# EAGLE design femtoUSB_r1.0.1_BREADBOARD (EAGLE 7.5.0)
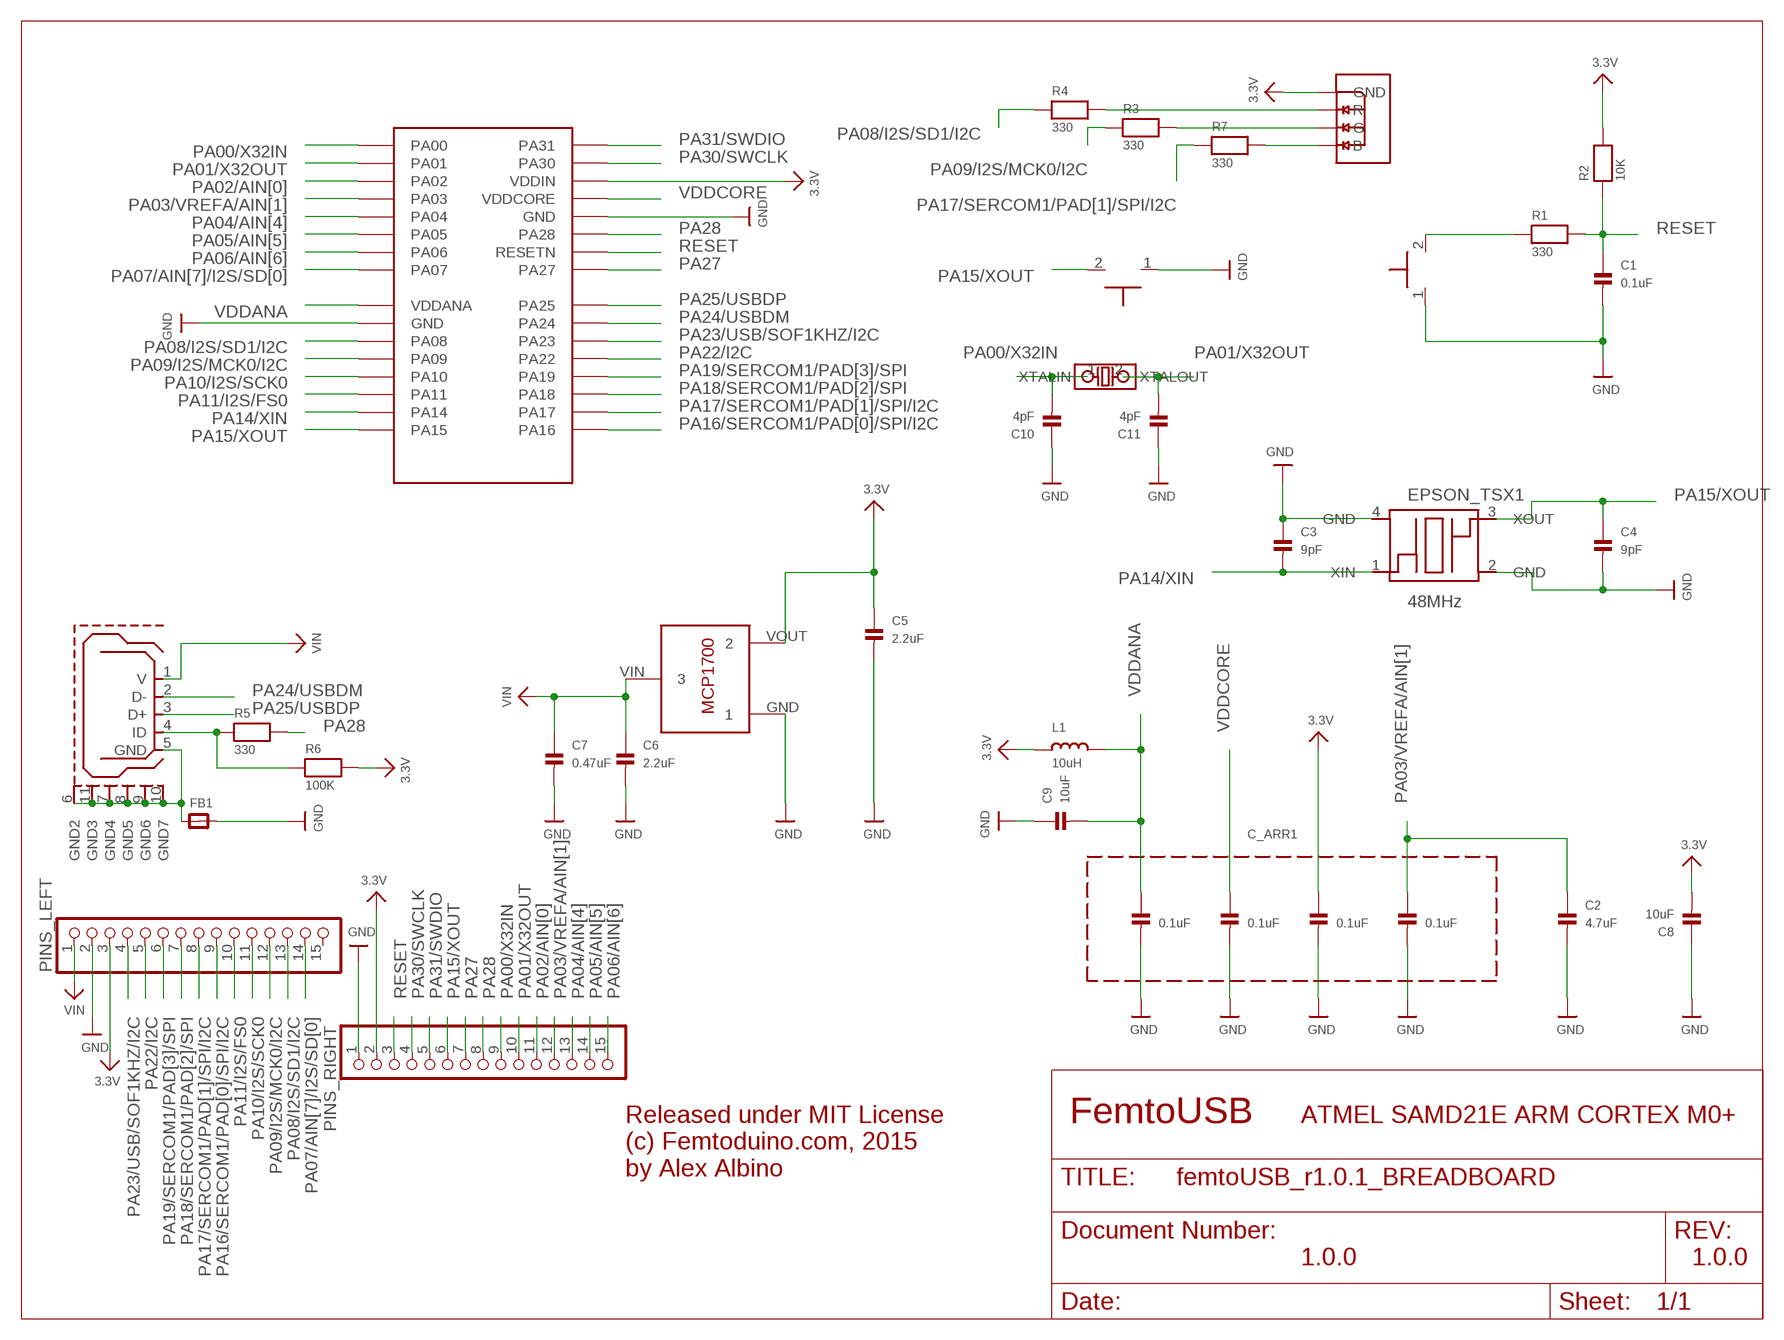
[diagram p0: schematic, sheet 1]

## Parts
BOOT_BTN  TACTILE_SWITCH_NO_GND_NO_BOSS  [SIDE_ACT_NO_GND_NO_BOSS]
BOOT_BTN1  TACTILE_SWITCH_NO_GND_NO_BOSS  [SIDE_ACT_NO_GND_NO_BOSS]
C1  0.1uF  CAP_CERAMIC_0402MP  [_0402MP]
C2  4.7uF  CAP_CERAMIC_0402MP  [_0402MP]
C3  9pF  CAP_CERAMIC_0402MP  [_0402MP]
C4  9pF  CAP_CERAMIC_0402MP  [_0402MP]
C5  2.2uF  CAP_CERAMIC_0402MP  [_0402MP]
C6  2.2uF  CAP_CERAMIC_0402MP  [_0402MP]
C7  0.47uF  CAP_CERAMIC_0402MP  [_0402MP]
C8  10uF  CAP_CERAMIC_0402MP  [_0402MP]
C9  10uF  CAP_CERAMIC_0402MP  [_0402MP]
C10  4pF  CAP_CERAMIC_0402MP  [_0402MP]
C11  4pF  CAP_CERAMIC_0402MP  [_0402MP]
C_ARR1  0.1uF  KEMET_CERAMIC_CAPACITOR_ARRAY_1X4  [CAPACITOR_ARRAY_1206_MONO_1X4]
EPSON_TSX1  48MHz  TSX-3225  [TSX-3225]
FB1  FERRITE_0603MP  [_0603MP]
IC1  ATSAMD21E18A-MUT  [QFN32]
L1  10uH  INDUCTOR_0603MP  [_0603MP]
LDO_VREG  MCP1700T-3302E/TT  [MCP1700T-3302E/TT]
MICRO_B_USB  USB_MICROB  [USB_MICROB_PACKAGE]
PINS_LEFT  HEADER-1X15  [1X15_ROUND_70]
PINS_RIGHT  HEADER-1X15  [1X15_ROUND_70]
R1  330  RESISTOR_0402MP  [_0402MP]
R2  10K  RESISTOR_0402MP  [_0402MP]
R3  330  RESISTOR_0402MP  [_0402MP]
R4  330  RESISTOR_0402MP  [_0402MP]
R5  330  RESISTOR_0402MP  [_0402MP]
R6  100K  RESISTOR_0402MP  [_0402MP]
R7  330  RESISTOR_0402MP  [_0402MP]
RGBLED  LRTB_R48G  [LRTB_R48G]
U$40  ABS06-107-32.768KHZ-T  [ABS06-107-32.768KHZ-T]

## Nets
3.3V: C5.1 C8.2 C_ARR1.5 IC1.30(VDDIN) L1.1 LDO_VREG.VOUT PINS_LEFT.3 PINS_RIGHT.2 R2.2 R6.2 RGBLED.1(GND)
GND: BOOT_BTN1.1 BOOT_BTN.1 C1.2 C2.2 C3.1 C4.2 C5.2 C6.2 C7.2 C8.1 C9.1 C10.1 C11.1 C_ARR1.2 C_ARR1.4 C_ARR1.6 C_ARR1.8 EPSON_TSX1.2(GND) EPSON_TSX1.4(GND) FB1.2 IC1.10(GND) IC1.28(GND) LDO_VREG.GND PINS_LEFT.2 PINS_RIGHT.1
GND_RAW: FB1.1 MICRO_B_USB.5(GND) MICRO_B_USB.6(GND2) MICRO_B_USB.7(GND4) MICRO_B_USB.8(GND5) MICRO_B_USB.9(GND6) MICRO_B_USB.10(GND7) MICRO_B_USB.11(GND3)
N$3: MICRO_B_USB.4(ID) R5.1 R6.1
N$26: BOOT_BTN1.2 R1.1
PA00/X32IN: C10.2 IC1.1(PA00) PINS_RIGHT.9 U$40.1(XTALIN)
PA01/X32OUT: C11.2 IC1.2(PA01) PINS_RIGHT.10 U$40.2(XTALOUT)
PA02/AIN[0]: IC1.3(PA02) PINS_RIGHT.11
PA03/VREFA/AIN[1]: C2.1 C_ARR1.7 IC1.4(PA03) PINS_RIGHT.12
PA04/AIN[4]: IC1.5(PA04) PINS_RIGHT.13
PA05/AIN[5]: IC1.6(PA05) PINS_RIGHT.14
PA06/AIN[6]: IC1.7(PA06) PINS_RIGHT.15
PA07/AIN[7]/I2S/SD[0]: IC1.8(PA07) PINS_LEFT.14
PA08/I2S/SD1/I2C: IC1.11(PA08) PINS_LEFT.13 R4.1
PA08_R: R4.2 RGBLED.2(R)
PA09/I2S/MCK0/I2C: IC1.12(PA09) PINS_LEFT.12 R3.1
PA09_G: R3.2 RGBLED.3(G)
PA10/I2S/SCK0: IC1.13(PA10) PINS_LEFT.11
PA11/I2S/FS0: IC1.14(PA11) PINS_LEFT.10
PA14/XIN: C3.2 EPSON_TSX1.1(XIN) IC1.15(PA14)
PA15/XOUT: BOOT_BTN.2 C4.1 EPSON_TSX1.3(XOUT) IC1.16(PA15) PINS_RIGHT.6
PA16/SERCOM1/PAD[0]/SPI/I2C: IC1.17(PA16) PINS_LEFT.9
PA17/SERCOM1/PAD[1]/SPI/I2C: IC1.18(PA17) PINS_LEFT.8 R7.1
PA17_B: R7.2 RGBLED.4(B)
PA18/SERCOM1/PAD[2]/SPI: IC1.19(PA18) PINS_LEFT.7
PA19/SERCOM1/PAD[3]/SPI: IC1.20(PA19) PINS_LEFT.6
PA22/I2C: IC1.21(PA22) PINS_LEFT.5
PA23/USB/SOF1KHZ/I2C: IC1.22(PA23) PINS_LEFT.4
PA24/USBDM: IC1.23(PA24) MICRO_B_USB.2(D-)
PA25/USBDP: IC1.24(PA25) MICRO_B_USB.3(D+)
PA27: IC1.25(PA27) PINS_RIGHT.7
PA28: IC1.27(PA28) PINS_RIGHT.8 R5.2
PA30/SWCLK: IC1.31(PA30) PINS_RIGHT.4
PA31/SWDIO: IC1.32(PA31) PINS_RIGHT.5
RESET: C1.1 IC1.26(RESETN) PINS_RIGHT.3 R1.2 R2.1
VDDANA: C9.2 C_ARR1.1 IC1.9(VDDANA) L1.2
VDDCORE: C_ARR1.3 IC1.29(VDDCORE)
VIN: C6.1 C7.1 LDO_VREG.VIN MICRO_B_USB.1(V) PINS_LEFT.1
Unconnected: PINS_LEFT.15

## Notes on the sheet
- FemtoUSB | ATMEL SAMD21E ARM CORTEX M0+
- Released under MIT License
  (c) Femtoduino.com, 2015
  by Alex Albino
- 1.0.0 | 1.0.0

## Library data of the parts
BOOT_BTN BOOT_BTN1 = omron_tactile_switch:TACTILE_SWITCH_NO_GND_NO_BOSS
C1 = microbuilder:CAP_CERAMIC: Ceramic Capacitors 0402 - 0402 Surface Mount Capacitors 16pF 50V 5% [Digikey: 445-4899-2-ND] 18pF 50V 5% [Digikey: 490-1281-2-ND] 22pF 50V 5% [Digikey: 490-1283-2-ND] 68pF 50V 5% [Digikey: 490-1289-2-ND] 0.1uF 10V 10% [Digikey: 490-1318-2-ND] 1.0uF 6.3V 10% [Digikey: 490-1320-2-ND] 0603 - 0603 Surface Mount Capacitors 16 pF 50V 5% [Digikey: 445-5051-2-ND] 22 pF 50V [Digikey: PCC220ACVTR-ND] 33 pF 50V 5% [Digikey: 490-1415-1-ND] 56pF 50V 5% [Digikey: 490-1421-1-ND] 220pF 50V 5% [Digikey: 445-1285-1-ND] 680 pF 50V 2200 pF 50V 5% C0G [Digikey: 445-1297-1-ND] 5600 pF 100V 5% X7R [Digikey: 478-3711-1-ND] 0.1 µF 25V 10% [Digikey: PCC2277TR-ND] 0.22 µF 16V 10% X7R [Digikey: 445-1318-1-ND] 1.0 µF 25V 10% [Digikey: 445-5146-2-ND] 0603 - RF Specific 3pF 250V +/-0.1pF RF [Digikey: 712-1347-1-ND] 18 pF 250V 5% [Digikey: 478-3505-1-ND or 712-1322-1-ND] 56 pF 250V 5% C0G RF [Digikey: 490-4867-1-ND] 68 pF 250V RF [Digikey: 490-4868-1-ND] 0805 - 0805 Surface Mount Capacitors 220 pF 250V 2% RF Ceramic Capacitor [Digikey: 712-1398-1-ND] 1000 pF 50V 2% NP0 Ceramic Capacitor [Digikey: 478-3760-1-ND] 0.1 µF 25V 10% Ceramic Capacitor [Digikey: PCC1828TR-ND] 1.0 µF 16V 10% Ceramic Capacitor[Digikey: 490-1691-2-ND] 10.0 µF 10V 10% Ceramic Capacitor[Digikey: 709-1228-1-ND] 10.0 uF 16V 10% Ceramic Capacitor [Digikey: 478-5165-2-ND] 47 uF 6.3V 20% Ceramic Capacitor [Digikey: 587-1779-1-ND or 399-5506-1-ND] 1206 - 1206 Surface Mount Capacitors 47uF 10V 20% Ceramic Capacitor [Digikey: 490-5528-1-ND or 399-5508-1-ND or 445-6010-1-ND] 100uF 6.3V -20%, +80% Y5V Ceramic Capacitor (Digikey: 490-4512-1-ND, Mouser: 81-GRM31CF50J107ZE1L); DIGIKEY_PART: 445-4958-1-ND
C2-C11 = microbuilder:CAP_CERAMIC: Ceramic Capacitors 0402 - 0402 Surface Mount Capacitors 16pF 50V 5% [Digikey: 445-4899-2-ND] 18pF 50V 5% [Digikey: 490-1281-2-ND] 22pF 50V 5% [Digikey: 490-1283-2-ND] 68pF 50V 5% [Digikey: 490-1289-2-ND] 0.1uF 10V 10% [Digikey: 490-1318-2-ND] 1.0uF 6.3V 10% [Digikey: 490-1320-2-ND] 0603 - 0603 Surface Mount Capacitors 16 pF 50V 5% [Digikey: 445-5051-2-ND] 22 pF 50V [Digikey: PCC220ACVTR-ND] 33 pF 50V 5% [Digikey: 490-1415-1-ND] 56pF 50V 5% [Digikey: 490-1421-1-ND] 220pF 50V 5% [Digikey: 445-1285-1-ND] 680 pF 50V 2200 pF 50V 5% C0G [Digikey: 445-1297-1-ND] 5600 pF 100V 5% X7R [Digikey: 478-3711-1-ND] 0.1 µF 25V 10% [Digikey: PCC2277TR-ND] 0.22 µF 16V 10% X7R [Digikey: 445-1318-1-ND] 1.0 µF 25V 10% [Digikey: 445-5146-2-ND] 0603 - RF Specific 3pF 250V +/-0.1pF RF [Digikey: 712-1347-1-ND] 18 pF 250V 5% [Digikey: 478-3505-1-ND or 712-1322-1-ND] 56 pF 250V 5% C0G RF [Digikey: 490-4867-1-ND] 68 pF 250V RF [Digikey: 490-4868-1-ND] 0805 - 0805 Surface Mount Capacitors 220 pF 250V 2% RF Ceramic Capacitor [Digikey: 712-1398-1-ND] 1000 pF 50V 2% NP0 Ceramic Capacitor [Digikey: 478-3760-1-ND] 0.1 µF 25V 10% Ceramic Capacitor [Digikey: PCC1828TR-ND] 1.0 µF 16V 10% Ceramic Capacitor[Digikey: 490-1691-2-ND] 10.0 µF 10V 10% Ceramic Capacitor[Digikey: 709-1228-1-ND] 10.0 uF 16V 10% Ceramic Capacitor [Digikey: 478-5165-2-ND] 47 uF 6.3V 20% Ceramic Capacitor [Digikey: 587-1779-1-ND or 399-5506-1-ND] 1206 - 1206 Surface Mount Capacitors 47uF 10V 20% Ceramic Capacitor [Digikey: 490-5528-1-ND or 399-5508-1-ND or 445-6010-1-ND] 100uF 6.3V -20%, +80% Y5V Ceramic Capacitor (Digikey: 490-4512-1-ND, Mouser: 81-GRM31CF50J107ZE1L)
C_ARR1 = array-capacitor:KEMET_CERAMIC_CAPACITOR_ARRAY_1X4
EPSON_TSX1 = crystals:TSX-3225; DIGIKEY_PART: TSX-3225 32.0000MF15X-B-ND
FB1 = microbuilder:FERRITE: Ferrite Bead 0603 MMZ1608B121C - 120 Ohm @ 100MHz, 600mA, 0.15 Ohm DC Resistance - Digikey: 445-2164-1-ND BK1608HW121-T - 120 Ohm, 600mA Ferrite Chip - Digikey: 587-1876-2-ND 0805 HZ0805B272R-10 - 2.7K Ohm @ 100MHz, 200mA, 0.8 Ohm DC Resistance - Digikey: 240-2504-1-ND (see also Murata BLM21BD272SN1L) MMZ2012Y152B - 1.5K Ohm @ 100MHz, 500mA, 0.4 Ohm DC Resistance - Digikey: 445-1560-1-ND - Mainly for high frequency (80-400MHz) MMZ2012R102A - 1K Ohm @ 100MHz, 500mA, 0.3 Ohm DC Resistance - Digikey: 445-1555-2-ND - More general purpose (10-200MHz)
IC1 = atmel-samd21:ATSAMD21E18A-MUT: This is the ATMEL SAMD21E QFN-32. ATSAMD21E18A; DIGIKEY_PART: ATSAMD21E18A-AU-ND
L1 = microbuilder:INDUCTOR: Inductors 0603: 10nH Ceramic Inductor - microwire antenna/RF (Digikey: 712-1434-2-ND) 0805: 560nH Ceramic Inductor - RF (Digikey: 553-1047-1-ND) 270nH Ceramic Inductor - Q = 40@250MHz, +-5%, 1 Ohm DC Resistance (Digikey: 535-10506-2-ND) 1007 (2518 Metric) SMT: 10µH 10% 250mOhm 820mA 1007 Inductor (Digikey: 587-2189-1-ND) 22µH 10% 500mOhm 580mA 1007 Inductor (Digikey: 587-2190-1-ND) 47µH 10% 950mOhm 420mA 1007 Inductor (Digikey: 587-2191-1-ND) 47µH 5% 100mOhm 1A 1008 Inductor (Digikey: 732-1816-1-ND) 5.0x5.0mm (Taiyo Yuden NR5040 Series) 6.8µH 20% 2.3A 64mOhm Inductor (Digikey: 587-2374-2-ND) 5.0x5.0mm (TDK VLC5045 Series) 4.7µH 20% 3.3A 34mOhm Inductor (Digikey: 445-6526-1-ND) 6.8µH 20% 2.7A 46mOhm Inductor (Digikey: 445-6527-1-ND) 6.0x6.0mm (TDK VLC6045 Series) 4.7µH 20% 3.8A 27mOhm Inductor (Digikey: 445-6538-2-ND) 6.8µH 20% 3A 41mOhm Inductor (Digikey: 445-6540-1-ND) 6.2µH 30% 2.2A 45mOhm Inductor (Digikey: SRR5028-6R2YCT-ND) - Not TDK VLC6045 but footprint should match 6.0x6.0mm (TDK SLF6045 Series) 6.8uH 30% 2A 33mOhm Inductor (Digikey: 445-4572-1-ND, Mouser: 810-SLF645T6R8N2R0PF)
LDO_VREG = MCP1700T-3302E_TT:MCP1700T-3302E/TT: Microchip LDO "MCP1700" in a 3-Pin SOT-23 package. ID: MCP1700T-3302E/TT
MICRO_B_USB = femtoduino:USB_MICROB: This is the hirose ZX62-B-5PA(11) MICRO-USB B Type female connection.
PINS_LEFT PINS_RIGHT = microbuilder:HEADER-1X15: 1x15 Header
R1 = microbuilder:RESISTOR: Resistors 0402 - 0402 Surface Mount Package 22 Ohm 1% 1/16W [Digikey: 311-22.0LRTR-ND] 33 Ohm 5% 1/16W 1.0K 5% 1/16W 1.5K 5% 1/16W 2.0K 1% 1/16W 10.0K 1% 1/16W [Digikey: 311-10.0KLRTR-ND] 10.0K 5% 1/16W [Digikey: RMCF0402JT10K0TR-ND] 12.1K 1% 1/16W [Digikey: 311-22.0LRTR-ND] 100.0K 5% 1/16W 0603 - 0603 Surface Mount Package 0 Ohm 1/10 Watt 1% Resistor 15 Ohm 1/10 Watt 1% Resistor 33 Ohm 1/10 Watt 1% Resistor 49.9 Ohm 1/10 Watt 1% Resistor 100 Ohm 1/10 Watt 1% Resistor 150 Ohm 1/10 Watt 1% Resistor 240 Ohm 1/10 Watt 1% Resistor 390 Ohm 1/10 Watt 1% Resistor 560 Ohm 1/10 Watt 1% Resistor 680 Ohm 1/10 Watt 1% Resistor 750 Ohm 1/10 Watt 1% Resistor 1.0K Ohm 1/10 Watt 1% Resistor 1.5K Ohm 1/10 Watt 1% Resistor 2.0K Ohm 1/10 Watt 1% Resistor 2.2K Ohm 1/10 Watt 1% Resistor 3.3K Ohm 1/10 Watt 1% Resistor 4.7K Ohm 1/10 Watt 1% Resistor 10.0K Ohm 1/10 Watt 1% Resistor 12.0K Ohm 1/10 Watt 1% Resistor 12.1K Ohm 1/10 Watt 1% Resistor 20.0K Ohm 1/10 Watt 1% Resistor 33.0K Ohm 1/10 Watt 1% Resistor 100.0K Ohm 1/10 Watt 1% Resistor 0805 - 0805 Surface Mount Package 0 Ohm 1/8 Watt 1% Resistor 33 Ohm 1/8 Watt 1% Resistor 100 Ohm 1/8 Watt 1% Resistor 150 Ohm 1/8 Watt 1% Resistor 200 Ohm 1/8 Watt 1% Resistor 240 Ohm 1/8 Watt 1% Resistor 330 Ohm 1/8 Watt 1% Resistor 390 Ohm 1/8 Watt 1% Resistor 470 Ohm 1/8 Watt 1% Resistor 1.0K Ohm 1/8 Watt 1% Resistor 1.5K Ohm 1/8 Watt 1% Resistor 2.0K Ohm 1/8 Watt 1% Resistor 4.7K Ohm 1/8 Watt 1% Resistor 5.1K Ohm 1/8 Watt 1% Resistor 5.6K Ohm 1/8 Watt 1% Resistor 10.0K Ohm 1/8 Watt 1% Resistor 22.0K Ohm 1/8 Watt 1% Resistor 33.0K Ohm 1/8 Watt 1% Resistor 100K Ohm 1/8 Watt 1% Resistor 1206 - 1206 Surface Mount Package 2012 - 2010 Surface Mount Package 0.11 Ohm 1/2 Watt 1% Resistor - Digikey: RHM.11UCT-ND; DIGIKEY_PART: 541-330JCT-ND
R2-R7 = microbuilder:RESISTOR: Resistors 0402 - 0402 Surface Mount Package 22 Ohm 1% 1/16W [Digikey: 311-22.0LRTR-ND] 33 Ohm 5% 1/16W 1.0K 5% 1/16W 1.5K 5% 1/16W 2.0K 1% 1/16W 10.0K 1% 1/16W [Digikey: 311-10.0KLRTR-ND] 10.0K 5% 1/16W [Digikey: RMCF0402JT10K0TR-ND] 12.1K 1% 1/16W [Digikey: 311-22.0LRTR-ND] 100.0K 5% 1/16W 0603 - 0603 Surface Mount Package 0 Ohm 1/10 Watt 1% Resistor 15 Ohm 1/10 Watt 1% Resistor 33 Ohm 1/10 Watt 1% Resistor 49.9 Ohm 1/10 Watt 1% Resistor 100 Ohm 1/10 Watt 1% Resistor 150 Ohm 1/10 Watt 1% Resistor 240 Ohm 1/10 Watt 1% Resistor 390 Ohm 1/10 Watt 1% Resistor 560 Ohm 1/10 Watt 1% Resistor 680 Ohm 1/10 Watt 1% Resistor 750 Ohm 1/10 Watt 1% Resistor 1.0K Ohm 1/10 Watt 1% Resistor 1.5K Ohm 1/10 Watt 1% Resistor 2.0K Ohm 1/10 Watt 1% Resistor 2.2K Ohm 1/10 Watt 1% Resistor 3.3K Ohm 1/10 Watt 1% Resistor 4.7K Ohm 1/10 Watt 1% Resistor 10.0K Ohm 1/10 Watt 1% Resistor 12.0K Ohm 1/10 Watt 1% Resistor 12.1K Ohm 1/10 Watt 1% Resistor 20.0K Ohm 1/10 Watt 1% Resistor 33.0K Ohm 1/10 Watt 1% Resistor 100.0K Ohm 1/10 Watt 1% Resistor 0805 - 0805 Surface Mount Package 0 Ohm 1/8 Watt 1% Resistor 33 Ohm 1/8 Watt 1% Resistor 100 Ohm 1/8 Watt 1% Resistor 150 Ohm 1/8 Watt 1% Resistor 200 Ohm 1/8 Watt 1% Resistor 240 Ohm 1/8 Watt 1% Resistor 330 Ohm 1/8 Watt 1% Resistor 390 Ohm 1/8 Watt 1% Resistor 470 Ohm 1/8 Watt 1% Resistor 1.0K Ohm 1/8 Watt 1% Resistor 1.5K Ohm 1/8 Watt 1% Resistor 2.0K Ohm 1/8 Watt 1% Resistor 4.7K Ohm 1/8 Watt 1% Resistor 5.1K Ohm 1/8 Watt 1% Resistor 5.6K Ohm 1/8 Watt 1% Resistor 10.0K Ohm 1/8 Watt 1% Resistor 22.0K Ohm 1/8 Watt 1% Resistor 33.0K Ohm 1/8 Watt 1% Resistor 100K Ohm 1/8 Watt 1% Resistor 1206 - 1206 Surface Mount Package 2012 - 2010 Surface Mount Package 0.11 Ohm 1/2 Watt 1% Resistor - Digikey: RHM.11UCT-ND
RGBLED = osram_opto_LED:LRTB_R48G
U$40 = crystals:ABS06-107-32.768KHZ-T: ABS06-107-32.768kHz-T Crystal Oscillator

## Board
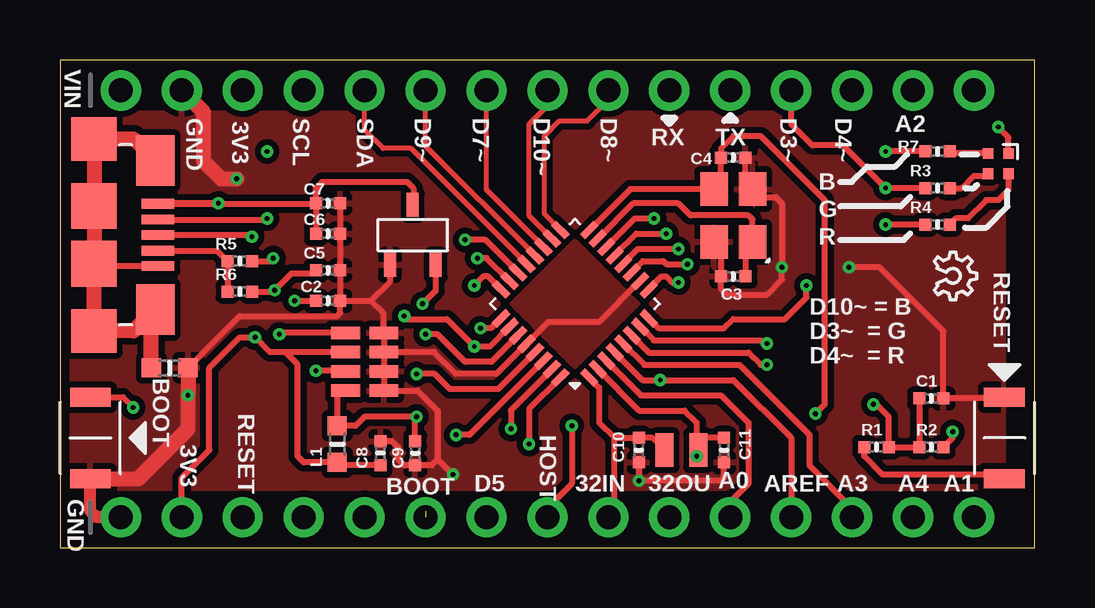
[diagram p1: board, top side]
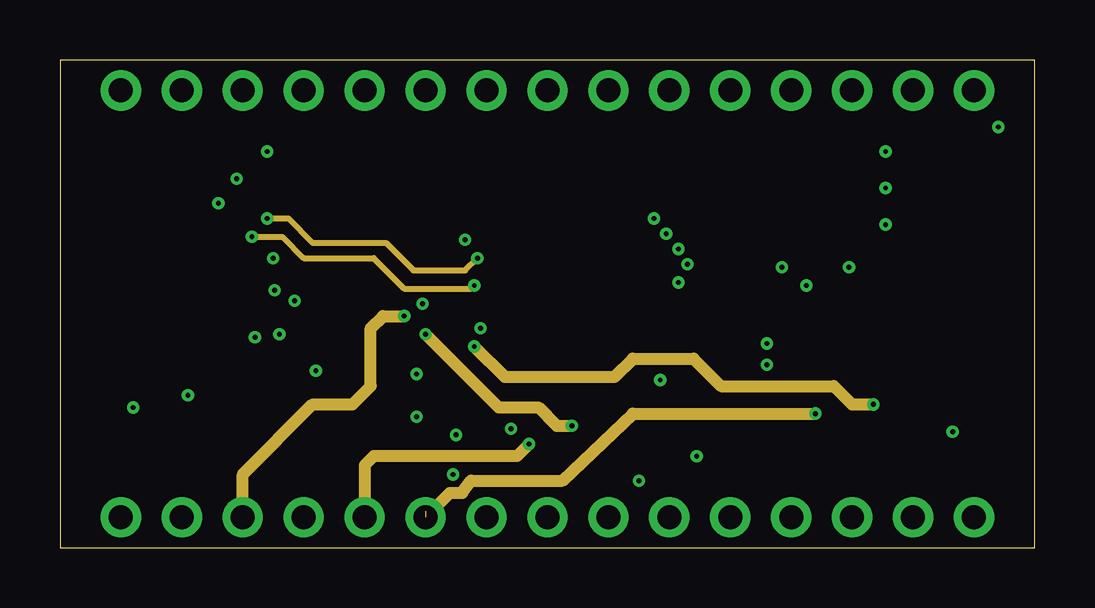
[diagram p2: board, inner layer Route2]
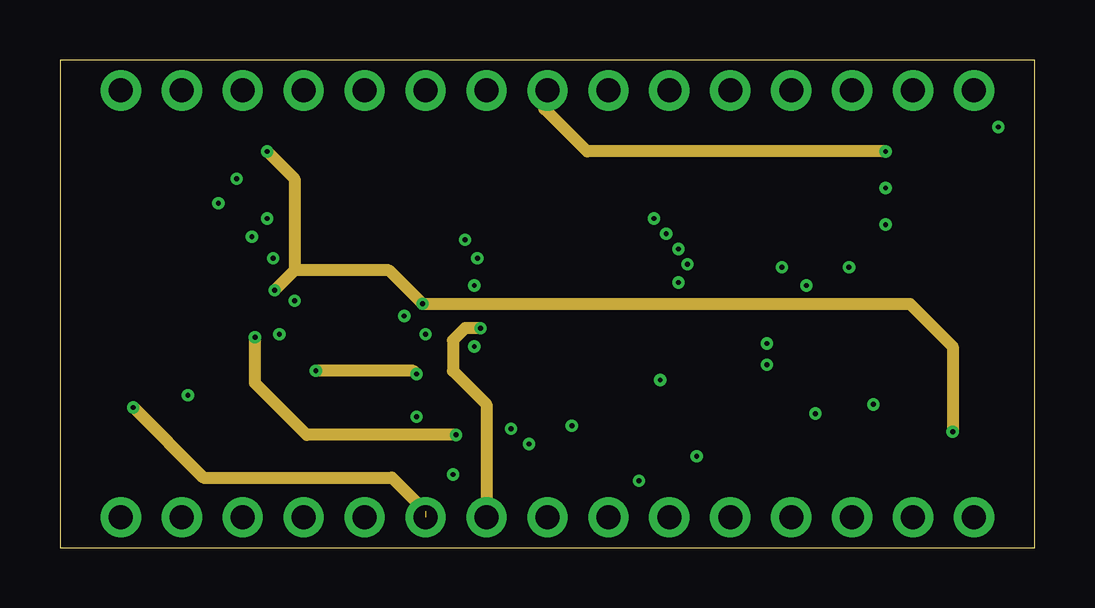
[diagram p3: board, inner layer Route15]
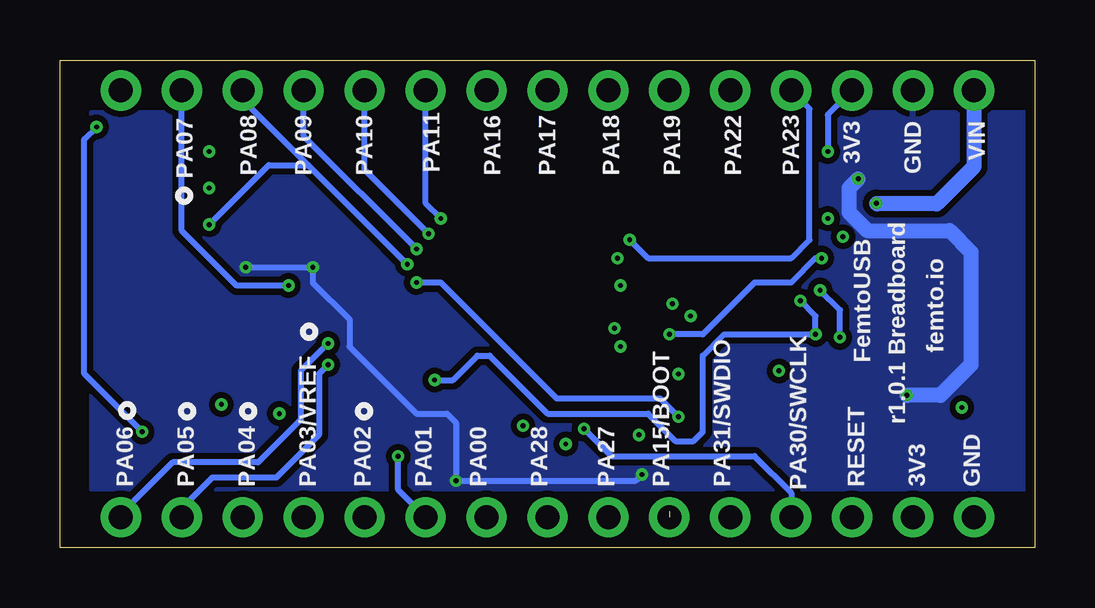
[diagram p4: board, bottom side, seen from below]

Size 40.64 x 20.32 mm. Coordinates in mm from the lower left corner, seen from the top.
Outline: 0,0 40.64,0 40.64,20.32 0,20.32 0,0
Copper layers (1+2*15+16): Top 0.035mm / dielectric 0.7mm / Route2 0.035mm / dielectric 0.15mm / Route15 0.035mm / dielectric 0.2mm / Bottom 0.035mm
Design rules "AQS_custom_4layer": minimum track width 5mil, minimum drill 5mil, track to track 6mil, track to pad 6mil, pad to pad 6mil, via to via 6mil, smd to smd 1mil, copper to edge 15mil, drill to drill 6mil, minimum pad ring 7mil, minimum via ring 3mil, stop-mask expansion 2mil, vias tented up to drill 10mil, thermal gap 10mil

### Footprints (pad centres in the part's own frame; a part is rotated, then mirrored left to right if it is on the bottom)
SIDE_ACT_NO_GND_NO_BOSS = smd 0.8 x 1.7: 1 -1.7,0; 2 1.7,0
_0402MP = smd 0.5 x 0.5: 1 -0.508,0; 2 0.508,0
CAPACITOR_ARRAY_1206_MONO_1X4 = smd 0.52 x 1.2: 1 -1.2,0.8; 2 -1.2,-0.8; 3 -0.4,0.8; 4 -0.4,-0.8; 5 0.4,0.8; 6 0.4,-0.8; 7 1.2,0.8; 8 1.2,-0.8
TSX-3225 = smd 1.4 x 1.15: 1 -1.1,-0.8; 2 1.1,-0.8; 3 1.1,0.8; 4 -1.1,0.8
_0603MP = smd 0.8 x 0.8: 1 -0.762,0; 2 0.762,0
QFN32 = smd 0.8 x 0.3: 1 -2.6,1.75; 2 -2.6,1.25; 3 -2.6,0.75; 4 -2.6,0.25; 5 -2.6,-0.25; 6 -2.6,-0.75; 7 -2.6,-1.25; 8 -2.6,-1.75; 17 2.6,-1.75; 18 2.6,-1.25; 19 2.6,-0.75; 20 2.6,-0.25; 21 2.6,0.25; 22 2.6,0.75; 23 2.6,1.25; 24 2.6,1.75 | smd 0.3 x 0.8: 9 -1.75,-2.6; 10 -1.25,-2.6; 11 -0.75,-2.6; 12 -0.25,-2.6; 13 0.25,-2.6; 14 0.75,-2.6; 15 1.25,-2.6; 16 1.75,-2.6; 25 1.75,2.6; 26 1.25,2.6; 27 0.75,2.6; 28 0.25,2.6; 29 -0.25,2.6; 30 -0.75,2.6; 31 -1.25,2.6; 32 -1.75,2.6
MCP1700T-3302E/TT = smd 0.5 x 1: GND -0.95,-1.25; VIN 0,1.25; VOUT 0.95,-1.25
USB_MICROB_PACKAGE = smd 0.4 x 1.35: 1 -1.3,-0.68; 2 -0.64,-0.68; 3 0,-0.68; 4 0.66,-0.68; 5 1.3,-0.68 | smd 2.1 x 1.6: 6 -3.1,-0.8; 11 3.1,-0.8 | smd 1.8 x 1.9: 7 -4,-3.35; 10 4,-3.35 | smd 1.9 x 1.9: 8 -1.2,-3.35; 9 1.2,-3.35
1X15_ROUND_70 = drill 1 pad 1.676: 1 -17.78,0; 2 -15.24,0; 3 -12.7,0; 4 -10.16,0; 5 -7.62,0; 6 -5.08,0; 7 -2.54,0; 8 0,0; 9 2.54,0; 10 5.08,0; 11 7.62,0; 12 10.16,0; 13 12.7,0; 14 15.24,0; 15 17.78,0
LRTB_R48G = smd 0.45 x 0.45: 1 0.425,0.425; 2 0.425,-0.425; 3 -0.425,-0.425; 4 -0.425,0.425
ABS06-107-32.768KHZ-T = smd 0.75 x 1.4: 1 -0.7,0; 2 0.7,0

### Placement (x,y rotation side)
BOOT_BTN  1.27,4.57 90 top
BOOT_BTN1  39.37,4.57 270 top
C1  36.32,6.22 0 top
C2  11.18,10.29 0 top
C3  28.07,11.3 0 top
C4  28.07,16.26 0 top
C5  11.18,11.56 0 top
C6  11.18,13.08 0 top
C7  11.18,14.35 0 top
C8  13.36,3.94 270 top
C9  14.81,3.94 90 top
C10  24.13,4.06 90 top
C11  27.69,4.06 90 top
C_ARR1  12.7,7.75 90 top
EPSON_TSX1  28.07,13.84 90 top
FB1  4.57,7.49 0 top
IC1  21.46,10.16 135 top
L1  11.56,4.32 90 top
LDO_VREG  14.71,13.03 0 top
MICRO_B_USB  4.77,13.03 270 top
OSH_LOGO  [OSHW_6X70_NOTEXT]  36.45,12.32 270 top
PINS_LEFT  20.32,19.05 0 top
PINS_RIGHT  20.32,1.27 0 top
R1  34.04,4.19 0 top
R2  36.32,4.19 0 top
R3  36.58,14.99 0 top
R4  36.58,13.46 0 top
R5  7.49,11.94 0 top
R6  7.49,10.67 0 top
R7  36.58,16.51 0 top
RGBLED  39.12,16 0 top
U$40  25.91,4.06 0 top

### Tracks (layer width: path | path; a pad name or v marks a point on that pad's centre or on a via)
3.3V  (via drill 0.2 pad 0.51)
  Top 0.254: RGBLED.1 39.54,17.1 v39.12,17.53 | C8.2 11.68,3.43 L1.1 10.16,3.56 9.91,3.81 9.91,7.64 9.4,8.15 | R6.2 8.89,10.67 v8.95,10.73 9.65,11.43 10.54,11.43 C5.1 | C_ARR1.5 9.4,8.15 | 9.4,8.15 8.74,8.15 v8.13,8.76 7.49,8.76 6.22,7.49 6.22,4.06 5.08,2.92 PINS_RIGHT.2 | LDO_VREG.VOUT 15.66,10.7 v15.11,10.16 | R2.2 37.21,4.57 v37.21,4.83 | IC1.30 17.06,4.7 v16.51,4.7
  Route15 0.508: 9.78,11.56 13.72,11.56 v15.11,10.16 35.43,10.16 37.21,8.38 v37.21,4.83 | 9.78,11.56 v8.95,10.73 | v8.64,16.51 9.78,15.37 9.78,11.56 | v16.51,4.7 10.29,4.7 8.13,6.86 v8.13,8.76
  Bottom 0.254: v39.12,17.53 39.62,17.02 39.62,7.24 v37.21,4.83 | PINS_LEFT.3 8.64,18.03 v8.64,16.51 | v8.13,8.76 8.13,9.91 v8.95,10.73
GND  (via drill 0.2 pad 0.51)
  Top 0.254: C7.2 C6.2 C5.2 C2.2 | C2.2 12.95,10.29 | 12.95,10.29 13.46,9.78 13.46,9.11 C_ARR1.8 C_ARR1.6 | C_ARR1.6 C_ARR1.4 C_ARR1.2 14.92,6.55 15.75,5.71 15.75,3.68 | LDO_VREG.GND 13.76,11.09 12.95,10.29 | 15.75,3.68 15.49,3.43 C9.1 14.35,3.43 14.1,3.68 14.1,4.19 13.84,4.45 C8.1 | FB1.2 7.49,9.65 11.56,9.65 11.68,9.78 C2.2 | IC1.10 22.47,9.4 20.35,9.4 IC1.28 18.19,7.24 16.51,7.24 15.6,8.15 C_ARR1.6 | C4.2 28.57,15.23 EPSON_TSX1.2 29.2,14.61 29.84,14.61 30.1,14.35 v30.1,11.68 30.1,11.18 29.46,10.54 27.81,10.54 27.56,10.79 C3.1 27.56,12.45 EPSON_TSX1.4 | BOOT_BTN1.1 39.32,6.22 C1.2 36.83,9.02 34.16,11.68 v32.89,11.68 | C10.1 v24.13,2.79 27.56,2.79 27.69,2.92 C11.1 | v16.38,3.05 15.75,3.68
  Top 0.508: PINS_RIGHT.1 1.52,1.27 1.27,1.52 BOOT_BTN.1
  Top 0.635: FB1.2 v5.33,6.35 5.33,4.95 3.25,2.87 BOOT_BTN.1 | PINS_LEFT.2 5.97,18.16 5.97,16.13 6.73,15.37 v7.37,15.37
  Bottom 0.254: v16.38,3.05 16.64,2.79 v24.13,2.79 24.13,5.21 24.51,5.59 25.78,5.59 28.57,8.38 28.57,9.53 30.1,11.05 v30.1,11.68 v32.89,11.68
  Bottom 0.635: v7.37,15.37 7.75,14.99 7.75,13.97 6.99,13.21 3.56,13.21 2.67,12.32 2.67,7.62 3.94,6.35 v5.33,6.35
  pour Bottom (isolate 0.254): 0.25,18.16 39.37,18.16 39.37,2.41 0.25,2.41
  pour Top (isolate 0.254): 0.25,18.16 39.37,18.16 39.37,2.41 0.25,2.41
GND_RAW
  Top 0.254: MICRO_B_USB.5 1.52,11.73 MICRO_B_USB.9
  Top 0.635: MICRO_B_USB.6 3.07,17.03 MICRO_B_USB.7 MICRO_B_USB.8 MICRO_B_USB.9 MICRO_B_USB.10 3.07,9.03 MICRO_B_USB.11 3.81,9.77 FB1.1
N$3
  Top 0.254: MICRO_B_USB.4 6.55,12.37 R5.1 R6.1
N$26
  Top 0.254: BOOT_BTN1.2 39.19,3.05 34.29,3.05 33.53,3.81 R1.1
PA00/X32IN
  Top 0.254: IC1.1 22.48,6.67 22.48,5.21 23.11,4.57 | 23.11,4.57 C10.2 24.7,4.57 U$40.1 | PINS_RIGHT.9 23.11,1.52 23.11,4.57
PA01/X32OUT  (via drill 0.2 pad 0.51)
  Top 0.254: 26.54,4.57 26.54,4.13 U$40.2 26.54,4 v26.54,3.81 | 26.54,4.57 26.54,5.21 26.04,5.71 24.14,5.71 IC1.2 | C11.2 26.54,4.57
  Bottom 0.254: PINS_RIGHT.10 26.54,2.41 v26.54,3.81
PA02/AIN[0]
  Top 0.254: IC1.3 24.21,6.35 27.56,6.35 28.7,5.21 28.7,2.67 27.94,1.91 PINS_RIGHT.11
PA03/VREFA/AIN[1]  (via drill 0.2 pad 0.51)
  Top 0.254: C_ARR1.7 9.2,8.95 v9.14,8.89 | v9.78,10.29 C2.1 | IC1.4 24.28,6.99 v25.02,6.99 28.07,6.99 30.48,4.57 PINS_RIGHT.12
  Bottom 0.254: v9.78,10.29 9.14,9.65 v9.14,8.89 12.95,8.89 13.84,8 13.84,4.83 14.22,4.45 14.99,4.45 16.13,5.59 20.32,5.59 22.73,8 23.24,8 24.26,6.99 v25.02,6.99
PA04/AIN[4]
  Top 0.254: IC1.5 24.36,7.62 28.32,7.62 31.24,4.7 31.24,3.43 33.02,1.65 PINS_RIGHT.13
PA05/AIN[5]  (via drill 0.2 pad 0.51)
  Top 0.254: IC1.6 24.56,8.13 28.7,8.13 29.21,7.62 v29.46,7.62
  Bottom 0.254: v29.46,7.62 29.84,7.24 29.84,4.7 31.62,2.92 34.29,2.92 35.56,1.65 PINS_RIGHT.14
PA06/AIN[6]  (via drill 0.2 pad 0.51)
  Top 0.254: IC1.7 24.75,8.64 29.21,8.64 29.34,8.51 v29.46,8.51
  Bottom 0.254: v29.46,8.51 30.61,7.37 30.61,5.33 32.38,3.56 35.94,3.56 38.1,1.4 PINS_RIGHT.15
PA07/AIN[7]/I2S/SD[0]  (via drill 0.2 pad 0.51)
  Top 0.254: IC1.8 24.95,9.14 27.69,9.14 28.07,9.53 30.23,9.53 31.11,10.41 v31.11,10.92
  Bottom 0.254: v31.11,10.92 33.27,10.92 35.56,13.21 PINS_LEFT.14
PA08/I2S/SD1/I2C  (via drill 0.2 pad 0.51)
  Top 0.254: R4.1 v34.42,13.46 | IC1.11 24.3,11.94 25.15,11.94 25.27,11.81 v26.16,11.81
  Bottom 0.254: v26.16,11.81 30.29,15.94 | 30.29,15.94 33.02,18.67 PINS_LEFT.13 | v34.42,13.46 31.94,15.94 30.29,15.94
PA08_R
  Top 0.254: RGBLED.2 39.54,14.9 39.12,14.48 38.61,14.48 37.85,13.72 37.34,13.72 R4.2
PA09/I2S/MCK0/I2C  (via drill 0.2 pad 0.51)
  Top 0.254: R3.1 v34.42,14.99 32.64,16.76 31.37,16.76 30.48,17.65 PINS_LEFT.12 | IC1.12 24.1,12.45 v25.78,12.45
  Bottom 0.254: v25.78,12.45 30.48,17.14 PINS_LEFT.12
PA09_G
  Top 0.254: R3.2 37.59,14.99 38.1,15.49 38.61,15.49 RGBLED.3
PA10/I2S/SCK0  (via drill 0.2 pad 0.51)
  Top 0.254: IC1.13 24.03,13.08 v25.27,13.08
  Bottom 0.254: v25.27,13.08 27.94,15.75 PINS_LEFT.11
PA11/I2S/FS0  (via drill 0.2 pad 0.51)
  Top 0.254: IC1.14 23.96,13.72 v24.77,13.72
  Bottom 0.254: v24.77,13.72 25.4,14.35 PINS_LEFT.10
PA14/XIN
  Top 0.254: EPSON_TSX1.1 28.87,12.79 | IC1.15 23.89,14.35 25.78,14.35 26.29,13.84 28.7,13.84 28.87,13.68 28.87,12.79 | 28.87,12.79 28.57,12.5 C3.2
PA15/XOUT  (via drill 0.2 pad 0.51)  (1 unrouted)
  Top 0.254: IC1.16 23.77,14.94 EPSON_TSX1.3 27.56,15.23 C4.1 27.56,16.64 28.07,17.14 29.21,17.14 31.88,14.48 31.88,5.97 v31.5,5.59 | BOOT_BTN.2 2.62,6.27 v3.05,5.84
  Route2 0.508: PINS_RIGHT.6 16.26,2.29 16.76,2.29 17.14,2.79 20.95,2.79 23.88,5.59 v31.5,5.59
  Route15 0.508: v3.05,5.84 5.97,2.92 13.84,2.92 15.24,1.52
PA16/SERCOM1/PAD[0]/SPI/I2C
  Top 0.203: IC1.17 20.19,13.9 20.19,17.14 20.83,17.78 21.97,17.78 22.86,18.67 PINS_LEFT.9
PA17/SERCOM1/PAD[1]/SPI/I2C  (via drill 0.2 pad 0.51)
  Top 0.203: IC1.18 19.56,13.83 19.56,17.65 20.32,18.41 PINS_LEFT.8
  Top 0.254: R7.1 v34.42,16.51
  Route15 0.508: v34.42,16.51 21.97,16.51 20.19,18.29 20.19,18.92 PINS_LEFT.8
PA17_B
  Top 0.254: RGBLED.4 37.17,16.43 R7.2
PA18/SERCOM1/PAD[2]/SPI
  Top 0.203: IC1.19 17.78,14.9 PINS_LEFT.7
PA19/SERCOM1/PAD[3]/SPI
  Top 0.203: IC1.20 15.24,16.74 PINS_LEFT.6
PA22/I2C
  Top 0.203: IC1.21 14.63,16.64 13.46,16.64 12.7,17.4 PINS_LEFT.5
PA23/USB/SOF1KHZ/I2C  (via drill 0.2 pad 0.51)
  Top 0.254: IC1.22 17.73,12.83 v16.89,12.83
  Bottom 0.254: PINS_LEFT.4 9.4,18.29 9.4,12.83 10.16,12.06 16.13,12.06 v16.89,12.83
PA24/USBDM  (via drill 0.2 pad 0.51)
  Top 0.254: MICRO_B_USB.2 8.46,13.67 v8.64,13.72 | IC1.23 17.79,12.06 v17.4,12.06
  Route2 0.254: v8.64,13.72 9.53,13.72 10.54,12.7 13.59,12.7 14.73,11.56 16.89,11.56 v17.4,12.06
PA25/USBDP  (via drill 0.2 pad 0.51)
  Top 0.254: MICRO_B_USB.3 7.92,13.03 v8,12.95 | IC1.24 17.84,11.3 17.65,11.3 v17.27,10.92
  Route2 0.254: v8,12.95 9.27,12.95 10.16,12.06 13.08,12.06 14.35,10.79 17.14,10.79 v17.27,10.92
PA27  (via drill 0.2 pad 0.51)
  Top 0.254: IC1.25 17.97,9.14 v17.53,9.14
  Route15 0.508: v17.53,9.14 16.89,9.14 16.38,8.64 16.38,7.37 17.78,5.97 PINS_RIGHT.7
PA28  (via drill 0.2 pad 0.51)
  Top 0.254: IC1.27 17.99,7.75 16.89,7.75 15.75,8.89 v15.24,8.89 | v21.34,5.08 21.34,2.67 20.32,1.65 PINS_RIGHT.8 | R5.2 8.76,11.94 v8.89,12.06
  Route2 0.508: v15.24,8.89 18.29,5.84 19.94,5.84 20.7,5.08 v21.34,5.08
  Bottom 0.254: v8.89,12.06 9.14,12.06 10.16,11.05 11.68,11.05 13.84,8.89 v15.24,8.89
PA30/SWCLK  (via drill 0.2 pad 0.51)
  Top 0.254: IC1.31 18.8,5.72 v18.8,4.95
  Bottom 0.254: v18.8,4.95 17.65,3.81 11.68,3.81 10.16,2.29 PINS_RIGHT.4
PA31/SWDIO  (via drill 0.2 pad 0.51)
  Top 0.254: IC1.32 19.56,5.78 v19.56,4.32
  Route2 0.508: v19.56,4.32 19.05,3.81 13.08,3.81 12.7,3.43 PINS_RIGHT.5
RESET  (via drill 0.2 pad 0.51)
  Top 0.254: C1.1 R2.1 R1.2 34.54,5.46 34.04,5.97 v33.91,5.97 | IC1.26 17.92,8.38 v17.27,8.38 16.13,9.53 14.48,9.53 v14.35,9.65
  Route2 0.508: v17.27,8.38 18.54,7.11 23.11,7.11 23.88,7.87 26.42,7.87 27.56,6.73 32.26,6.73 33.02,5.97 v33.91,5.97 | PINS_RIGHT.3 7.62,3.05 10.54,5.97 12.19,5.97 12.95,6.73 12.95,9.14 13.46,9.65 v14.35,9.65
VDDANA  (via drill 0.2 pad 0.51)
  Top 0.254: C9.2 14.81,5.38 v14.86,5.46 12.7,5.46 12.32,5.08 L1.2 11.56,6.55 C_ARR1.1 | IC1.9 25.08,11.3 25.27,11.3 25.53,11.05 v25.78,11.05
  Bottom 0.254: v14.86,5.46 15.62,6.22 19.94,6.22 24.77,11.05 v25.78,11.05
VDDCORE  (via drill 0.2 pad 0.51)
  Top 0.254: C_ARR1.3 11.88,7.37 v10.67,7.37 | IC1.29 18.26,6.6 16.26,6.6 15.62,7.24 v14.86,7.24
  Route15 0.508: v14.86,7.24 14.73,7.37 v10.67,7.37
VIN  (via drill 0.2 pad 0.51)
  Top 0.254: v6.6,14.35 4.11,14.35 MICRO_B_USB.1 10.65,14.33 C7.1 | C7.1 C6.1 | C7.1 10.67,14.99 10.92,15.24 14.48,15.24 14.73,14.99 14.73,14.31 LDO_VREG.VIN
  Bottom 0.635: PINS_LEFT.1 2.54,15.88 MICRO_B_USB.1 6.58,14.33 v6.6,14.35

### Text on the board
tNames: VIN | GND | 3V3 | SCL | SDA | D9~ | D7~ | D10~ | D8~ | D3~ | D4~ | A2 | RX | TX | B | G | R | D10~ = B | D3~ = G | D4~ = R | RESET | RESET | HOST | BOOT | 3V3 | BOOT | D5 | 32IN | 32OU | A0 | AREF | A3 | A4 | A1 | GND
bNames: VIN | GND | 3V3 | PA23 | PA22 | PA19 | PA18 | PA17 | PA16 | PA11 | PA10 | PA09 | PA08 | PA07 | femto.io | FemtoUSB | r1.0.1 Breadboard | GND | 3V3 | RESET | PA31/SWDIO | PA15/BOOT | PA27 | PA28 | PA00 | PA01 | PA02 | PA03/VREF | PA04 | PA05 | PA06 | PA30/SWCLK